# Altium schematic sheet sla2216-conn-mso.SchDoc
size A4; DocumentNumber: 3; SheetNumber: 3; SheetTotal: 6
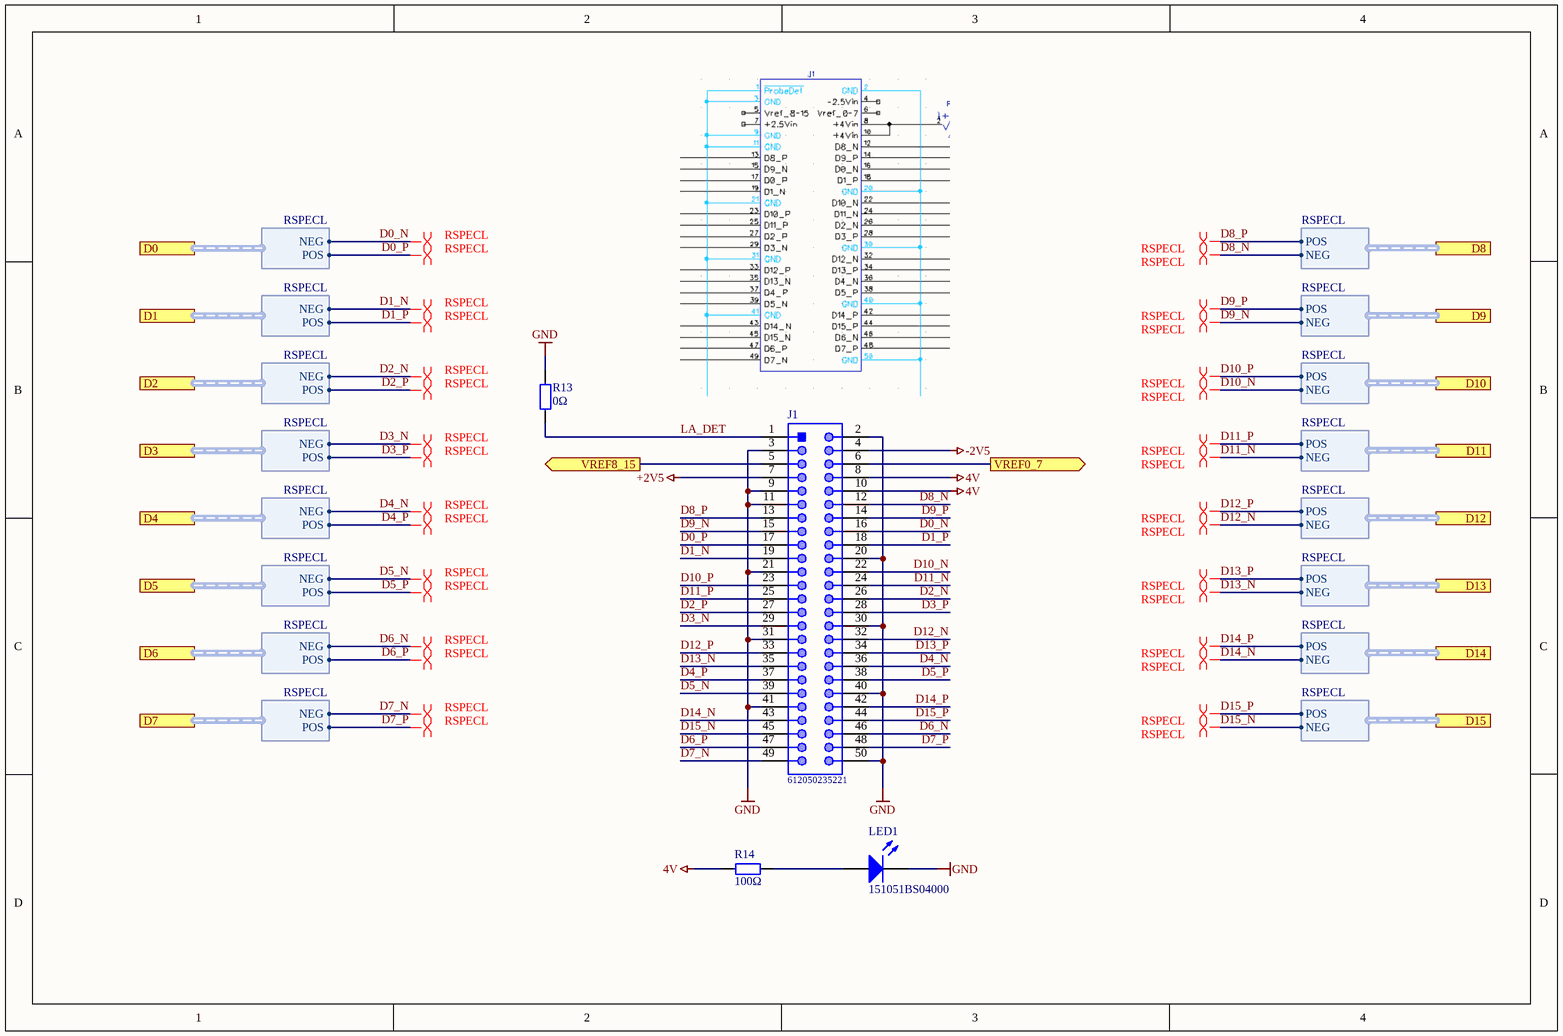
[diagram p0: sla2216-conn-mso.SchDoc]

## Parts
J1  612050235221  [612050235221]
LED1  151051BS04000  [Type 5mm]
R13  Resistance: 0Ω  [RES 0603/1608]
R14  Resistance: 100Ω  [RES 0603/1608]

## Ports
D0 (harness RSPECL), D1 (harness RSPECL), D2 (harness RSPECL), D3 (harness RSPECL), D4 (harness RSPECL), D5 (harness RSPECL), D6 (harness RSPECL), D7 (harness RSPECL), D8 (harness RSPECL), D9 (harness RSPECL), D10 (harness RSPECL), D11 (harness RSPECL), D12 (harness RSPECL), D13 (harness RSPECL), D14 (harness RSPECL), D15 (harness RSPECL), VREF0_7 (out), VREF8_15 (out)

## Harnesses
RSPECL: POS, NEG

## Nets
4V: J1.8 J1.10 R14.2
+2V5: J1.7
-2V5: J1.4
GND: J1.2 J1.3 J1.9 J1.11 J1.20 J1.21 J1.30 J1.31 J1.40 J1.41 J1.50 LED1.1(K) R13.1
D0_N: J1.16 ; port D0.NEG
D0_P: J1.17 ; port D0.POS
D1_N: J1.19 ; port D1.NEG
D1_P: J1.18 ; port D1.POS
D2_N: J1.26 ; port D2.NEG
D2_P: J1.27 ; port D2.POS
D3_N: J1.29 ; port D3.NEG
D3_P: J1.28 ; port D3.POS
D4_N: J1.36 ; port D4.NEG
D4_P: J1.37 ; port D4.POS
D5_N: J1.39 ; port D5.NEG
D5_P: J1.38 ; port D5.POS
D6_N: J1.46 ; port D6.NEG
D6_P: J1.47 ; port D6.POS
D7_N: J1.49 ; port D7.NEG
D7_P: J1.48 ; port D7.POS
D8_N: J1.12 ; port D8.NEG
D8_P: J1.13 ; port D8.POS
D9_N: J1.15 ; port D9.NEG
D9_P: J1.14 ; port D9.POS
D10_N: J1.22 ; port D10.NEG
D10_P: J1.23 ; port D10.POS
D11_N: J1.24 ; port D11.NEG
D11_P: J1.25 ; port D11.POS
D12_N: J1.32 ; port D12.NEG
D12_P: J1.33 ; port D12.POS
D13_N: J1.35 ; port D13.NEG
D13_P: J1.34 ; port D13.POS
D14_N: J1.43 ; port D14.NEG
D14_P: J1.42 ; port D14.POS
D15_N: J1.45 ; port D15.NEG
D15_P: J1.44 ; port D15.POS
LA_DET: J1.1 R13.2
VREF0_7: J1.6 ; port VREF0_7
VREF8_15: J1.5 ; port VREF8_15
NetLED1_2: LED1.2(A) R14.1

## Layout directives
differential pair; differential pair class RSPECL: D0_N, D0_P, D1_N, D1_P, D2_N, D2_P, D3_N, D3_P, D4_N, D4_P, D5_N, D5_P, D6_N, D6_P, D7_N, D7_P, D8_N, D8_P, D9_N, D9_P, D10_N, D10_P, D11_N, D11_P, D12_N, D12_P, D13_N, D13_P, D14_N, D14_P, D15_N, D15_P

## Library data of the parts
J1 = CMP-1502-00050-1: Male Box Header WR-BHD, THT, Angled, pitch 2.54 mm, 50 pins; Manufacturer: Wurth Elektronik; Withstanding Voltage: 500VAC; Pin Number: 50; Pitch: 2.54mm; Contact Resistance: 20mOhm; Working Voltage: 250VAC; Published Date: August2018; Publisher: WurthElektronik; Package Reference: 612050235221; Mounting Technology: THT; Part Number: 612050235221; Manufacturer URL: http://www.we-online.de; Packaging: Tray; Operating Temperature: -40to125degC; Orientation: Angled; Datasheet URL: https://katalog.we-online.de/em/datasheet/6120xx235221.pdf; Gender: Male
LED1 = CMP-1488-00009-1: THT LED round mono-color color lens, WL-TMRW, Blue; Manufacturer: Wuerth Elektronik; PackageReference: Type 5mm; ComponentLink2Description: Datasheet; ComponentLink1Description: Manufacturer URL; Emitting color: Blue; ComponentLink1URL: http://www.we-online.com; PartNumber: 151051BS04000; ComponentLink2URL: http://katalog.we-online.de/pbs/datasheet/7448042001.pdfhttp://katalog.we-online.de/pbs/datasheet/7448042001.pdfhttp://katalog.we-online.de/pbs/datasheet/7448042001.pdfhttp://katalog.we-online.de/pbs/datasheet/151051BS04000.pdf
R13 = Resistor: BOMref: RES_0Ω_5%_50V_0603; Tolerance: 5%; Voltage Rating: 50V; Package: 0603
R14 = Resistor: BOMref: RES_100Ω_5%_50V_0603; Tolerance: 5%; Voltage Rating: 50V; Package: 0603